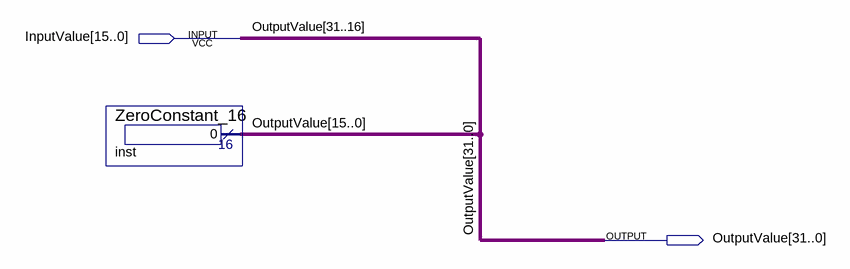
[diagram p0: schematic sheet]
// Quartus schematic LoadUpperImmediate.bdf as structural Verilog: 1 symbols, 2 pins
module LoadUpperImmediate (
  input  [15:0] InputValue,
  output [31:0] OutputValue
);

  ZeroConstant_16 inst (.result(OutputValue[15:0]));

  assign OutputValue[31:16] = InputValue;
endmodule
